# EAGLE design Schematic (EAGLE 7.4.0)
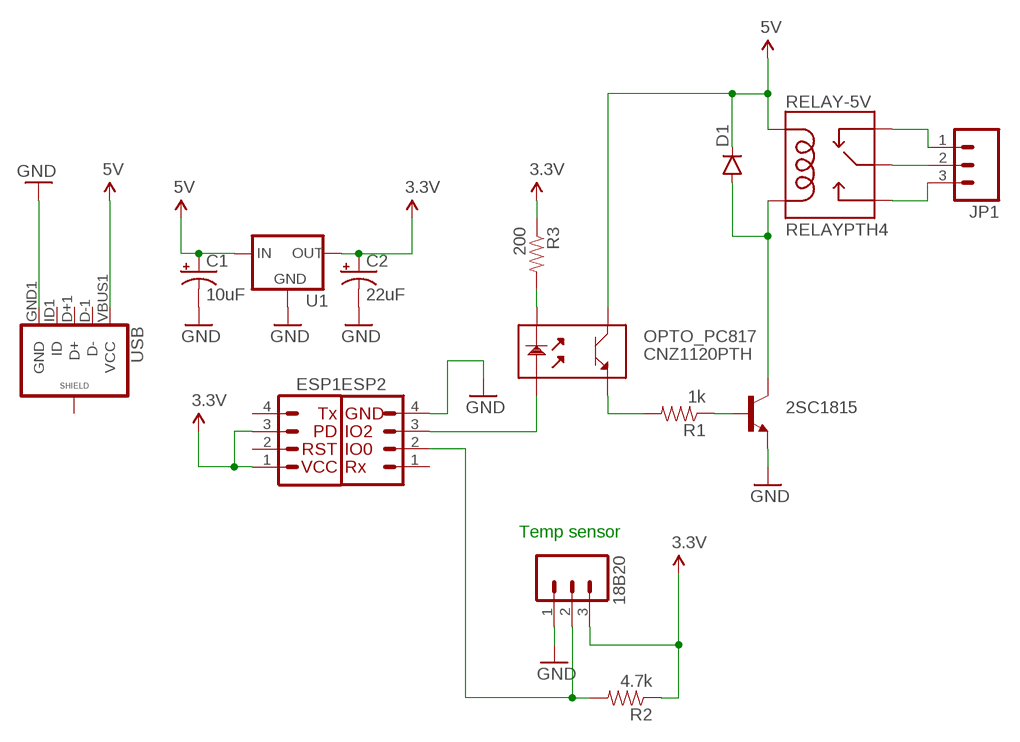
[diagram p0: schematic, sheet 1]

## Parts
2SC1815  TRANSISTOR_NPNTO-92-AMMO  [TO-92-AMMO]
18B20  M03POLAR  [MOLEX-1X3]
C1  10uF  10UF-25V-20%(PTH)  [CPOL-RADIAL-10UF-25V]
C2  22uF  10UF-25V-20%(PTH)  [CPOL-RADIAL-10UF-25V]
D1  DIODEPTH  [DIODE-1N4001]
ESP1  I2C_STANDARD_NO_SILK  [1X04_NO_SILK]
ESP2  I2C_STANDARD  [1X04]
JP1  M031X03_NO_SILK  [1X03_NO_SILK]
OPTO_PC817  CNZ1120PTH  [CNZ1120]
R1  1k  10KOHM-1/4W5%(PTH)  [AXIAL-0.3]
R2  4.7k  10KOHM-1/4W5%(PTH)  [AXIAL-0.3]
R3  200  10KOHM-1/4W5%(PTH)  [AXIAL-0.3]
RELAY-5V  RELAYPTH4  [RELAY-JZC]
U1  V_REG_78XXSINK  [TO220-IGO]
USB  USB_MICROB_PLUGCONN-11752  [USB-B-MICRO-SMD_V03]

## Nets
3.3V: 18B20.3 C2.1(+) ESP1.1 ESP1.3 R2.P$1 R3.P$1 U1.GND(OUT)
5V: C1.1(+) D1.C OPTO_PC817.4 RELAY-5V.5(COIL1) U1.OUT(IN) USB.VBUS1(VCC)
GND: 2SC1815.1(E) 18B20.1 C1.2(-) C2.2(-) ESP2.4 U1.IN(GND) USB.GND1(GND)
N$1: OPTO_PC817.3 R1.P$2
N$2: 2SC1815.2(C) D1.A RELAY-5V.1(COIL2)
N$3: 18B20.2 ESP2.2 R2.P$2
N$4: ESP2.3 OPTO_PC817.2
N$5: OPTO_PC817.1 R3.P$2
N$6: JP1.1 RELAY-5V.2(NC)
N$7: JP1.3 RELAY-5V.3(NO)
N$8: JP1.2 RELAY-5V.4(MAIN)
N$9: 2SC1815.3(B) R1.P$1
Unconnected: ESP1.2 ESP1.4 ESP2.1 USB.D+1(D+) USB.D-1(D-) USB.ID1(ID) USB.SHIELD1(SHIELD) USB.SHIELD2(SHIELD) USB.SHIELD3(SHIELD)

## Notes on the sheet
- Temp sensor

## Library data of the parts
2SC1815 = SparkFun-DiscreteSemi:TRANSISTOR_NPN: Generic NPN BJT MMBT2222A - TRANS-08049 (SOT-23, 1A 40V) MPSA42 - TRANS-09116 (SOT-23, 500mA 300V) MMBT5088LT1G - TRANS-11160 (SOT-23, 50 mA 30V) BC547 - COM-08928 <http://www.sparkfun.com/products/8928> (TO-92 45V 100mA) (1.Collector 2.Base 3.Emitter) 2N3904 - COM-00521 <http://www.sparkfun.com/products/521> (TO-92 40V 200mA) (1.Emitter 2.Base 3.Collector) P2N2222A - COM-12852 <http://www.sparkfun.com/products/12852> (TO-92 40V 600mA) (1.Collector 2.Base 3.Emitter)
18B20 = SparkFun-Connectors:M03: Header 3 Standard 3-pin 0.1" header. Use with straight break away headers (SKU : PRT-00116), right angle break away headers (PRT-00553), swiss pins (PRT-00743), machine pins (PRT-00117), and female headers (PRT-00115). Molex polarized connector foot print use with SKU : PRT-08232 with associated crimp pins and housings.
C1 C2 = SparkFun-Capacitors:10UF-25V-20%(PTH): CAP-08440; PROD_ID: CAP-08440
D1 = SparkFun-DiscreteSemi:DIODE: Diode These are standard reverse protection diodes and small signal diodes. SMA package can handle up to about 1A. SOD-323 can handle about 200mA. What the SOD-323 package when ordering, there are some mfgs out there that are 5-pin packages.
ESP1 = ESP8266_2:I2C_STANDARD: SparkFun has standardized on a pinout for all I2C based sensor breakouts. This pinout allows I2C boards to be plugged directly into the headers on Arduino Uno compatible boards, and to be daisy chained easily.
ESP2 = ESP8266:I2C_STANDARD: SparkFun has standardized on a pinout for all I2C based sensor breakouts. This pinout allows I2C boards to be plugged directly into the headers on Arduino Uno compatible boards, and to be daisy chained easily.
JP1 = ESP8266:M03: Header 3 Standard 3-pin 0.1" header. Use with straight break away headers (SKU : PRT-00116), right angle break away headers (PRT-00553), swiss pins (PRT-00743), machine pins (PRT-00117), and female headers (PRT-00115). Molex polarized connector foot print use with SKU : PRT-08232 with associated crimp pins and housings.
OPTO_PC817 = SparkFun-DiscreteSemi:CNZ1120: LED-to-NPN optoisolator
R1-R3 = SparkFun-Resistors:10KOHM-1/4W5%(PTH): RES-09435; PROD_ID: RES-9435; VALUE: 10k
RELAY-5V = SparkFun-Electromechanical:RELAY: SPDT relay (COM-00101)
U1 = SparkFun-PowerIC:V_REG_78XX: Voltage Regulator Standard 78xx regulator. IGO (Input Ground Output). Spark Fun Electronics SKU : COM-00107
USB = SparkFun-Connectors:USB_MICROB_PLUG: USB Micro-B connectors Some male, some female. Watch your step!; PROD_ID: CONN-11752

## Board
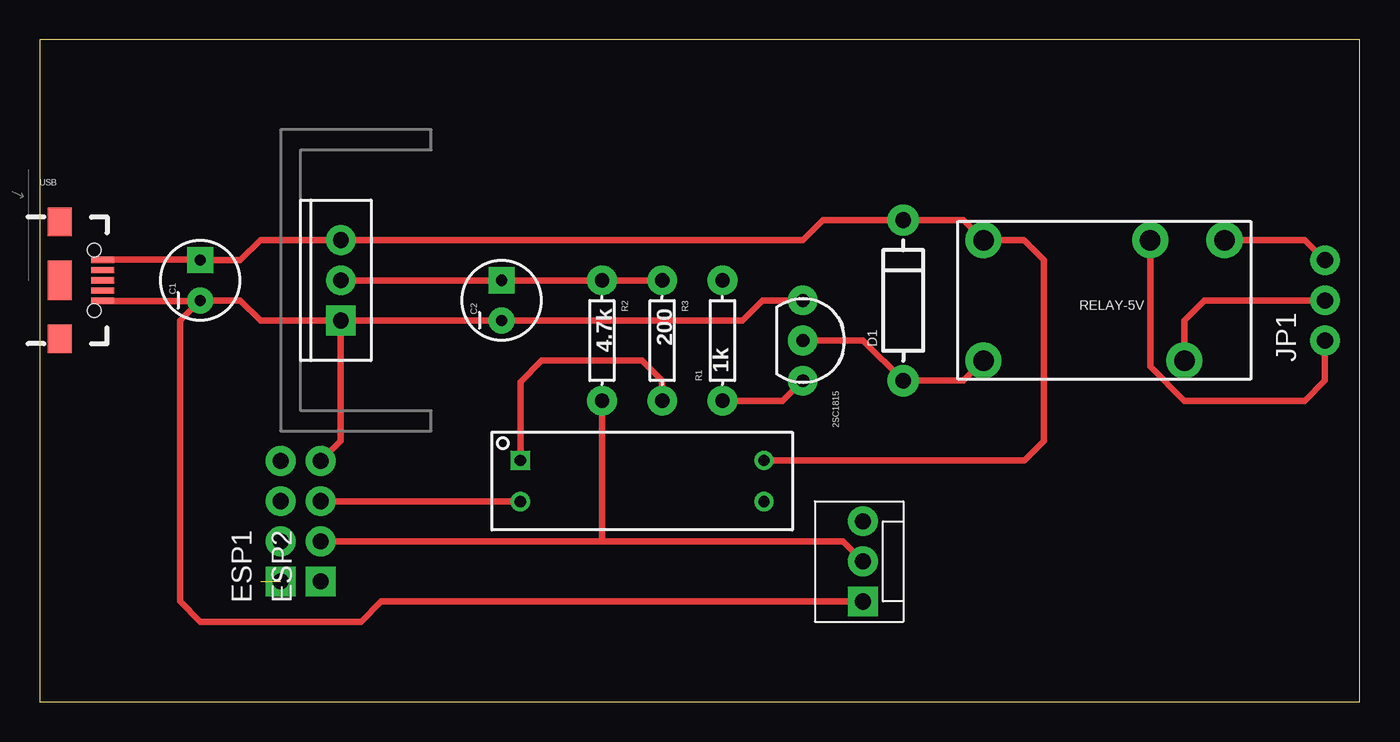
[diagram p1: board, top side]
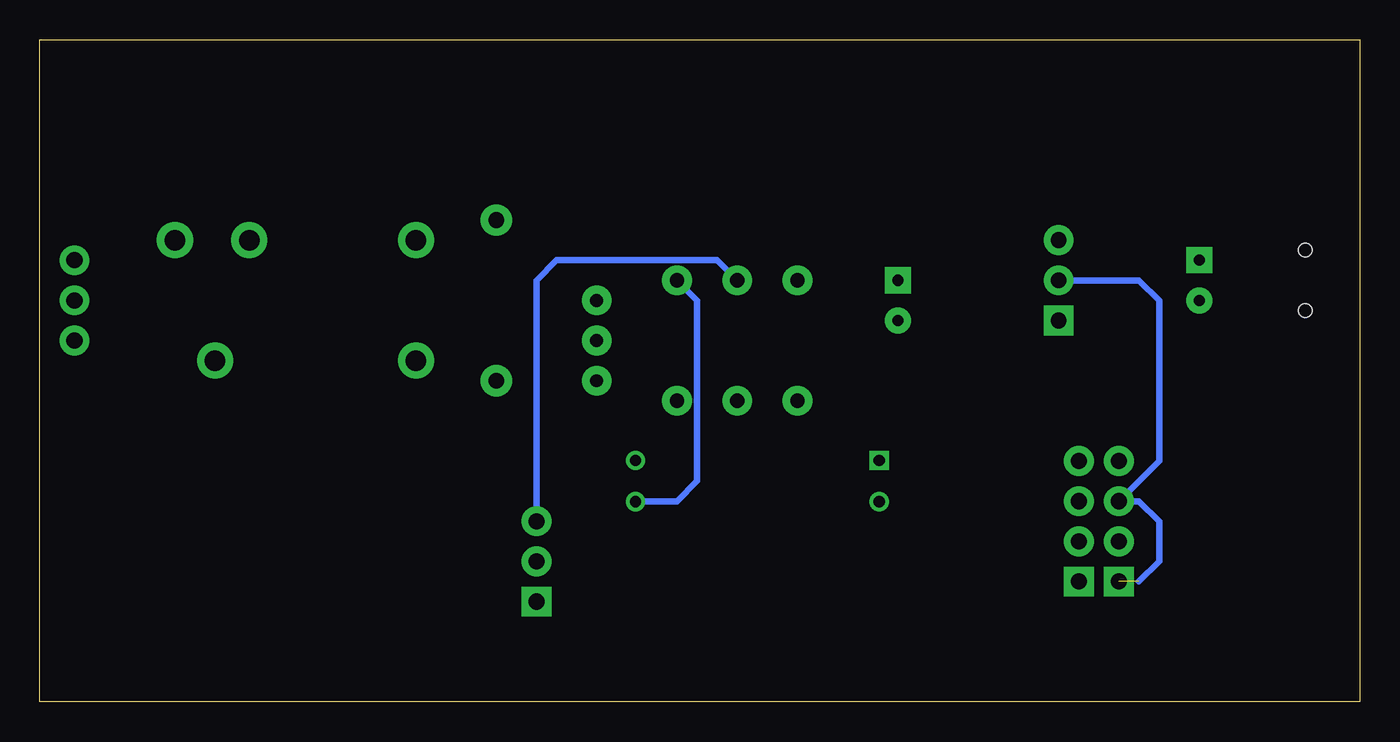
[diagram p2: board, bottom side, seen from below]

Size 83.49 x 41.9 mm. Coordinates in mm from the lower left corner, seen from the top.
Outline: 0,0 83.49,0 83.49,41.9 0,41.9 0,0
Copper layers (1*16): Top 0.035mm / dielectric 1.5mm / Bottom 0.035mm
Design rules "default": minimum track width 10mil, minimum drill 24mil, track to track 8mil, track to pad 8mil, pad to pad 8mil, via to via 8mil, smd to smd 8mil, copper to edge 40mil, drill to drill 8mil, minimum pad ring 10mil, minimum via ring 8mil, stop-mask expansion 4mil, vias tented up to drill 0mil, thermal gap 10mil

### Footprints (pad centres in the part's own frame; a part is rotated, then mirrored left to right if it is on the bottom)
TO-92-AMMO = drill 0.813 pad 1.88: 1 -2.54,0; 2 0,0; 3 2.54,0
MOLEX-1X3 = drill 1.016 pad 1.88 square: 1 0,0 | drill 1.016 pad 1.88: 2 2.54,0; 3 5.08,0
CPOL-RADIAL-10UF-25V = drill 0.7 pad 1.651 square: 1 1.27,0 | drill 0.7 pad 1.651: 2 -1.27,0
DIODE-1N4001 = drill 1 pad 1.981: A -5.08,0; C 5.08,0
1X04_NO_SILK = drill 1.016 pad 1.88 square: 1 0,0 | drill 1.016 pad 1.88: 2 2.54,0; 3 5.08,0; 4 7.62,0
1X04 = drill 1.016 pad 1.88 square: 1 0,0 | drill 1.016 pad 1.88: 2 2.54,0; 3 5.08,0; 4 7.62,0
1X03_NO_SILK = drill 1.016 pad 1.88: 1 0,0; 2 2.54,0; 3 5.08,0
CNZ1120 = drill 0.7 square: 1 -7.7,1.3 | drill 0.7: 2 -7.7,-1.3; 3 7.7,-1.3; 4 7.7,1.3
AXIAL-0.3 = drill 0.9 pad 1.88: P$1 -3.81,0; P$2 3.81,0
RELAY-JZC = drill 1.3 pad 2.286: 1 3.81,-8.89; 2 -3.81,1.651; 3 -3.81,6.35; 4 3.81,3.81; 5 -3.81,-8.89
TO220-IGO = drill 1 pad 1.88: GND 0,0; OUT 2.54,0 | drill 1 pad 1.88 square: IN -2.54,0
USB-B-MICRO-SMD_V03 = smd 1.45 x 0.4: D+1 2.725,0; D-1 2.725,0.65; GND1 2.725,-1.3; ID1 2.725,-0.65; VBUS1 2.725,1.3 | smd 1.5 x 1.8: SHIELD1 0,3.685; SHIELD2 0,-3.685 | smd 1.5 x 2.5: SHIELD3 0,0 | hole 0.85: 2.2,1.9; 2.2,-1.9

### Placement (x,y rotation side)
2SC1815  48.26,22.86 270 top
18B20  52.07,6.35 90 top
C1  10.16,26.67 90 top
C2  29.21,25.4 90 top
D1  54.61,25.4 90 top
ESP1  15.24,7.62 90 top
ESP2  17.78,7.62 90 top
JP1  81.28,22.86 90 top
OPTO_PC817  38.1,13.97 0 top
R1  43.18,22.86 90 top
R2  35.56,22.86 270 top
R3  39.37,22.86 270 top
RELAY-5V  68.58,25.4 270 top
U1  19.05,26.67 90 top
USB  1.27,26.67 0 top

### Tracks (layer width: path | path; a pad name or v marks a point on that pad's centre or on a via)
3.3V  (1 unrouted)
  Top 0.406: U1.GND C2.1 R2.P$1 R3.P$1
  Bottom 0.406: U1.GND 13.97,26.67 12.7,25.4 12.7,15.24 ESP1.3 13.97,12.7 12.7,11.43 12.7,8.89 13.97,7.62 | 18B20.3 52.07,26.67 50.8,27.94 40.64,27.94 R3.P$1
5V
  Top 0.406: USB.VBUS1 10.13,27.97 C1.1 12.7,27.94 13.97,29.21 U1.OUT 48.26,29.21 49.53,30.48 D1.C 58.42,30.48 RELAY-5V.5 62.23,29.21 63.5,27.94 63.5,16.51 62.26,15.27 OPTO_PC817.4
GND
  Top 0.406: U1.IN C2.2 44.45,24.13 45.72,25.4 2SC1815.1 | U1.IN 19.05,16.51 ESP2.4 | USB.GND1 10.13,25.37 C1.2 | C1.2 12.7,25.4 13.97,24.13 U1.IN | 18B20.1 21.59,6.35 20.32,5.08 10.16,5.08 8.89,6.35 8.89,24.13 C1.2
N$1
  Bottom 0.406: R1.P$2 41.91,25.4 41.91,13.97 43.18,12.7 45.77,12.7 OPTO_PC817.3
N$2
  Top 0.406: RELAY-5V.1 58.42,20.32 D1.A 52.07,22.86 2SC1815.2
N$3
  Top 0.406: ESP2.2 35.56,10.16 | 35.56,10.16 50.8,10.16 18B20.2 | R2.P$2 35.56,10.16
N$4
  Top 0.406: ESP2.3 30.37,12.7 OPTO_PC817.2
N$5
  Top 0.406: OPTO_PC817.1 30.4,20.24 31.75,21.59 38.1,21.59 39.37,20.32 R3.P$2
N$6
  Top 0.406: RELAY-5V.2 70.23,21.21 72.39,19.05 80.01,19.05 81.28,20.32 JP1.1
N$7
  Top 0.406: RELAY-5V.3 80.01,29.21 JP1.3
N$8
  Top 0.406: RELAY-5V.4 72.39,24.13 73.66,25.4 JP1.2
N$9
  Top 0.406: R1.P$1 46.99,19.05 2SC1815.3